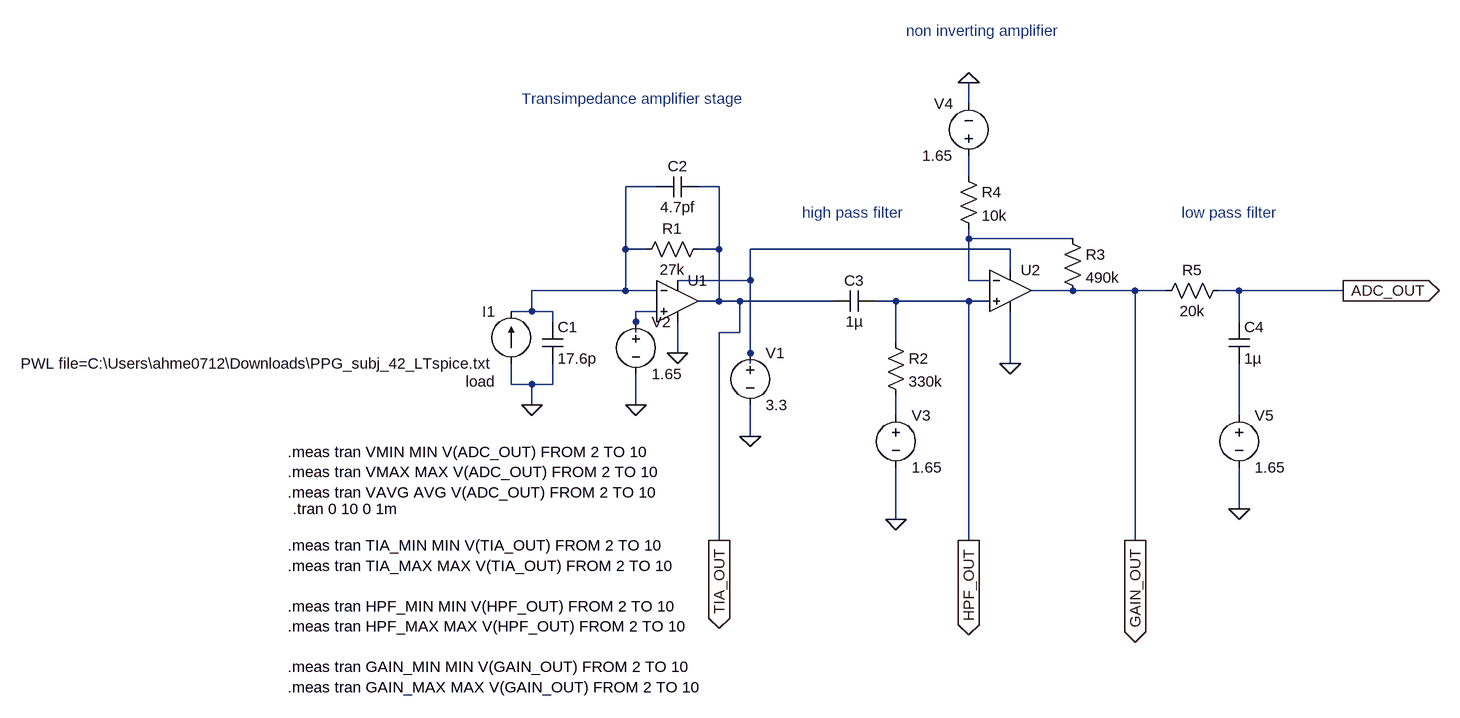
[diagram p0: schematic PPG LTSPICE SIMULATION.asc]
PPG LTSPICE SIMULATION.asc, the LTspice schematic file:
Version 4.1
SHEET 1 1548 680
WIRE 400 -224 400 -256
WIRE 400 -112 400 -144
WIRE -80 -96 -128 -96
WIRE 16 -96 -16 -96
WIRE 400 -16 400 -32
WIRE 560 -16 400 -16
WIRE -128 0 -128 -96
WIRE -96 0 -128 0
WIRE 16 0 16 -96
WIRE 16 0 -16 0
WIRE 464 0 64 0
WIRE 464 32 464 0
WIRE 64 48 64 0
WIRE 64 48 -48 48
WIRE 400 48 400 -16
WIRE 432 48 400 48
WIRE -128 64 -128 0
WIRE -128 64 -272 64
WIRE -80 64 -128 64
WIRE 560 64 496 64
WIRE 656 64 560 64
WIRE 704 64 656 64
WIRE 816 64 784 64
WIRE 976 64 816 64
WIRE 16 80 16 0
WIRE 16 80 -16 80
WIRE 48 80 16 80
WIRE 192 80 48 80
WIRE 288 80 256 80
WIRE 400 80 288 80
WIRE 432 80 400 80
WIRE -272 96 -272 64
WIRE -272 96 -304 96
WIRE -240 96 -272 96
WIRE -80 96 -112 96
WIRE -240 112 -240 96
WIRE -112 112 -112 96
WIRE 816 112 816 64
WIRE -112 128 -112 112
WIRE 48 128 48 80
WIRE 48 128 16 128
WIRE 288 144 288 80
WIRE -48 160 -48 112
WIRE 64 160 64 48
WIRE 64 176 64 160
WIRE 464 176 464 96
WIRE -304 208 -304 176
WIRE -272 208 -304 208
WIRE -240 208 -240 176
WIRE -240 208 -272 208
WIRE -272 240 -272 208
WIRE -112 240 -112 192
WIRE 288 256 288 224
WIRE 816 256 816 176
WIRE 64 288 64 240
WIRE 816 400 816 336
WIRE 288 416 288 336
WIRE 16 448 16 128
WIRE 400 448 400 80
WIRE 656 448 656 64
FLAG -272 240 0
FLAG -48 160 0
FLAG 64 288 0
FLAG -112 240 0
FLAG 288 416 0
FLAG 464 176 0
FLAG 400 -256 0
FLAG 976 64 ADC_OUT
IOPIN 976 64 Out
FLAG 816 400 0
FLAG 16 448 TIA_OUT
IOPIN 16 448 Out
FLAG 400 448 HPF_OUT
IOPIN 400 448 Out
FLAG 656 448 GAIN_OUT
IOPIN 656 448 Out
SYMBOL current -304 176 R180
WINDOW 0 24 80 Left 2
WINDOW 3 24 0 Left 2
WINDOW 123 0 0 Left 0
WINDOW 39 24 -28 Left 2
SYMATTR InstName I1
SYMATTR Value PWL file=C:\Users\ahme0712\Downloads\PPG_subj_42_LTspice.txt
SYMATTR SpiceLine load
SYMBOL cap -256 112 R0
SYMATTR InstName C1
SYMATTR Value 17.6p
SYMBOL cap -16 -112 R90
WINDOW 0 0 32 VBottom 2
WINDOW 3 32 32 VTop 2
SYMATTR InstName C2
SYMATTR Value 4.7pf
SYMBOL voltage 64 144 R0
WINDOW 123 0 0 Left 0
WINDOW 39 0 0 Left 0
SYMATTR InstName V1
SYMATTR Value 3.3
SYMBOL OpAmps\\UniversalOpAmp -48 80 R0
SYMATTR InstName U1
SYMBOL res 0 -16 R90
WINDOW 0 0 56 VBottom 2
WINDOW 3 32 56 VTop 2
SYMATTR InstName R1
SYMATTR Value 27k
SYMBOL voltage -112 96 R0
WINDOW 123 0 0 Left 0
WINDOW 39 0 0 Left 0
SYMATTR InstName V2
SYMATTR Value 1.65
SYMBOL cap 256 64 R90
WINDOW 0 0 32 VBottom 2
WINDOW 3 32 32 VTop 2
SYMATTR InstName C3
SYMATTR Value 1µ
SYMBOL res 272 128 R0
SYMATTR InstName R2
SYMATTR Value 330k
SYMBOL voltage 288 240 R0
WINDOW 123 0 0 Left 0
WINDOW 39 0 0 Left 0
SYMATTR InstName V3
SYMATTR Value 1.65
SYMBOL OpAmps\\UniversalOpAmp 464 64 R0
SYMATTR InstName U2
SYMBOL voltage 400 -128 R180
WINDOW 0 24 96 Left 2
WINDOW 3 24 16 Left 2
WINDOW 123 0 0 Left 0
WINDOW 39 0 0 Left 0
SYMATTR InstName V4
SYMATTR Value 1.65
SYMBOL res 544 -32 R0
SYMATTR InstName R3
SYMATTR Value 490k
SYMBOL res 384 -128 R0
SYMATTR InstName R4
SYMATTR Value 10k
SYMBOL res 800 48 R90
WINDOW 0 0 56 VBottom 2
WINDOW 3 32 56 VTop 2
SYMATTR InstName R5
SYMATTR Value 20k
SYMBOL cap 800 112 R0
SYMATTR InstName C4
SYMATTR Value 1µ
SYMBOL voltage 816 240 R0
WINDOW 123 0 0 Left 0
WINDOW 39 0 0 Left 0
SYMATTR InstName V5
SYMATTR Value 1.65
TEXT -288 -232 Left 2 ;Transimpedance amplifier stage
TEXT 144 -56 Left 2 ;high pass filter
TEXT 304 -336 Left 2 ;non inverting amplifier
TEXT 728 -56 Left 2 ;low pass filter
TEXT -648 312 Left 2 !.meas tran VMIN MIN V(ADC_OUT) FROM 2 TO 10\n.meas tran VMAX MAX V(ADC_OUT) FROM 2 TO 10\n.meas tran VAVG AVG V(ADC_OUT) FROM 2 TO 10
TEXT -640 400 Left 2 !.tran 0 10 0 1m
TEXT -648 456 Left 2 !.meas tran TIA_MIN MIN V(TIA_OUT) FROM 2 TO 10\n.meas tran TIA_MAX MAX V(TIA_OUT) FROM 2 TO 10\n \n.meas tran HPF_MIN MIN V(HPF_OUT) FROM 2 TO 10\n.meas tran HPF_MAX MAX V(HPF_OUT) FROM 2 TO 10\n \n.meas tran GAIN_MIN MIN V(GAIN_OUT) FROM 2 TO 10\n.meas tran GAIN_MAX MAX V(GAIN_OUT) FROM 2 TO 10

The netlist it stands for:
* PPG LTSPICE SIMULATION.asc
I1 0 N002 PWL file=C:\Users\ahme0712\Downloads\PPG_subj_42_LTspice.txt load
C1 N002 0 17.6p
C2 TIA_OUT N002 4.7pf
V1 N004 0 3.3
X§U1 N005 N002 N004 0 TIA_OUT level1 Avol=1Meg GBW=10Meg Vos=0 En=0 Enk=0 In=0 Ink=0 Rin=500Meg  ; pins In+ In- V+ V- OUT
R1 TIA_OUT N002 27k
V2 N005 0 1.65
C3 HPF_OUT TIA_OUT 1µ
R2 HPF_OUT N006 330k
V3 N006 0 1.65
X§U2 HPF_OUT N003 N004 0 GAIN_OUT level1 Avol=1Meg GBW=10Meg Vos=0 En=0 Enk=0 In=0 Ink=0 Rin=500Meg  ; pins In+ In- V+ V- OUT
V4 N001 0 1.65
R3 N003 GAIN_OUT 490k
R4 N001 N003 10k
R5 ADC_OUT GAIN_OUT 20k
C4 ADC_OUT N007 1µ
V5 N007 0 1.65
* Transimpedance amplifier stage
* high pass filter
* non inverting amplifier
* low pass filter
.meas tran VMIN MIN V(ADC_OUT) FROM 2 TO 10
.meas tran VMAX MAX V(ADC_OUT) FROM 2 TO 10
.meas tran VAVG AVG V(ADC_OUT) FROM 2 TO 10
.tran 0 10 0 1m
.meas tran TIA_MIN MIN V(TIA_OUT) FROM 2 TO 10
.meas tran TIA_MAX MAX V(TIA_OUT) FROM 2 TO 10
.meas tran HPF_MIN MIN V(HPF_OUT) FROM 2 TO 10
.meas tran HPF_MAX MAX V(HPF_OUT) FROM 2 TO 10
.meas tran GAIN_MIN MIN V(GAIN_OUT) FROM 2 TO 10
.meas tran GAIN_MAX MAX V(GAIN_OUT) FROM 2 TO 10
.lib UniversalOpAmp1.lib
.backanno
.end